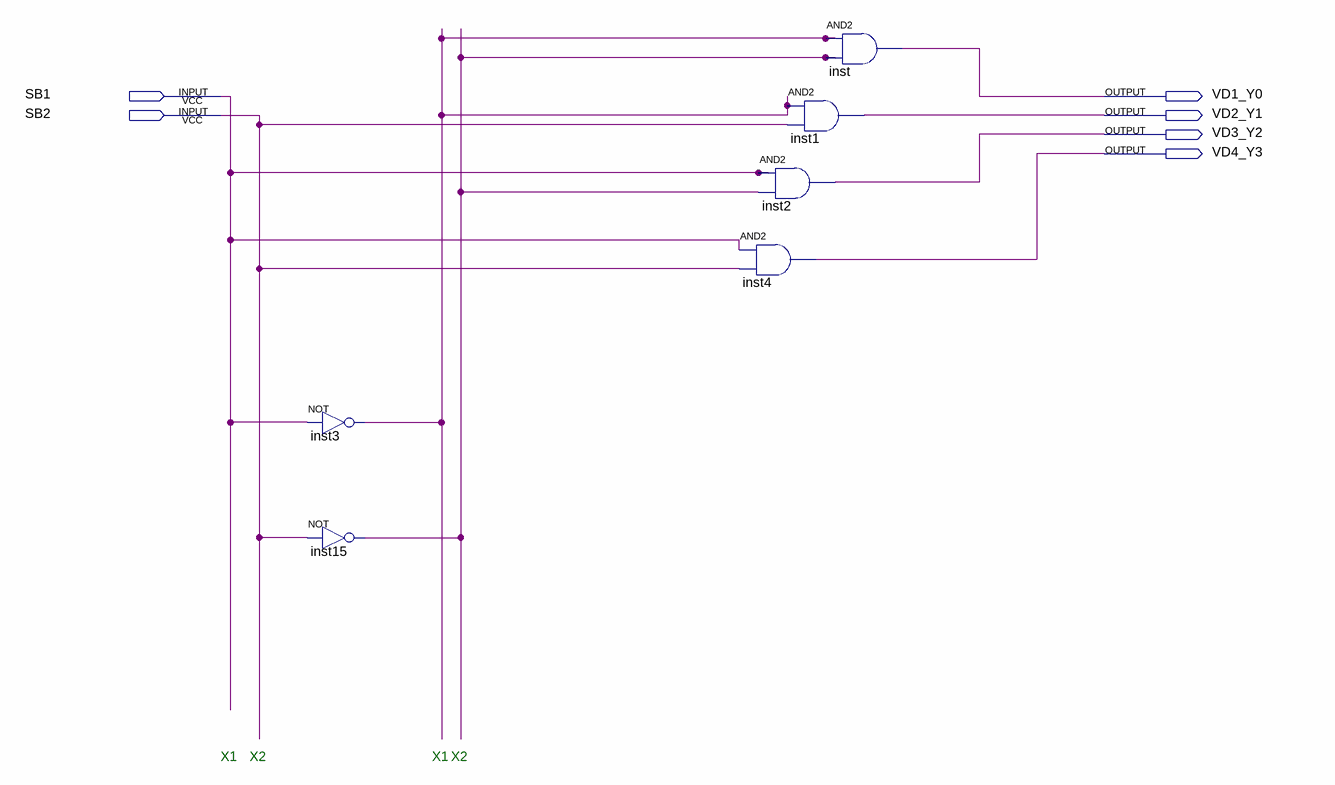
[diagram p0: schematic sheet]
// Quartus schematic lab5.bdf as structural Verilog: 6 symbols, 6 pins
module lab5 (
  input  SB1,
  input  SB2,
  output VD1_Y0,
  output VD2_Y1,
  output VD3_Y2,
  output VD4_Y3
);

  wire inst3_out, inst15_out;

  not inst3 (inst3_out, SB1);
  not inst15 (inst15_out, SB2);
  and inst4 (VD4_Y3, SB1, SB2);
  and inst (VD1_Y0, inst3_out, inst15_out);
  and inst1 (VD2_Y1, inst3_out, SB2);
  and inst2 (VD3_Y2, SB1, inst15_out);

  // Notes on the sheet:
  //   X1
  //   X2
  //   X1
  //   X2
endmodule
